# EasyEDA Pro project Doodlebot v2_2025-06-04.epro

# Schematic Schematic1
Board Name: Board1; Create Date: 2025-06-04; Page Name: P1; Project Name: Doodlebot v2; Schematic Name: Schematic1; Update Date: 2025-06-04; Company: EasyEDA.com; Page Size: A4; Version: V1.0
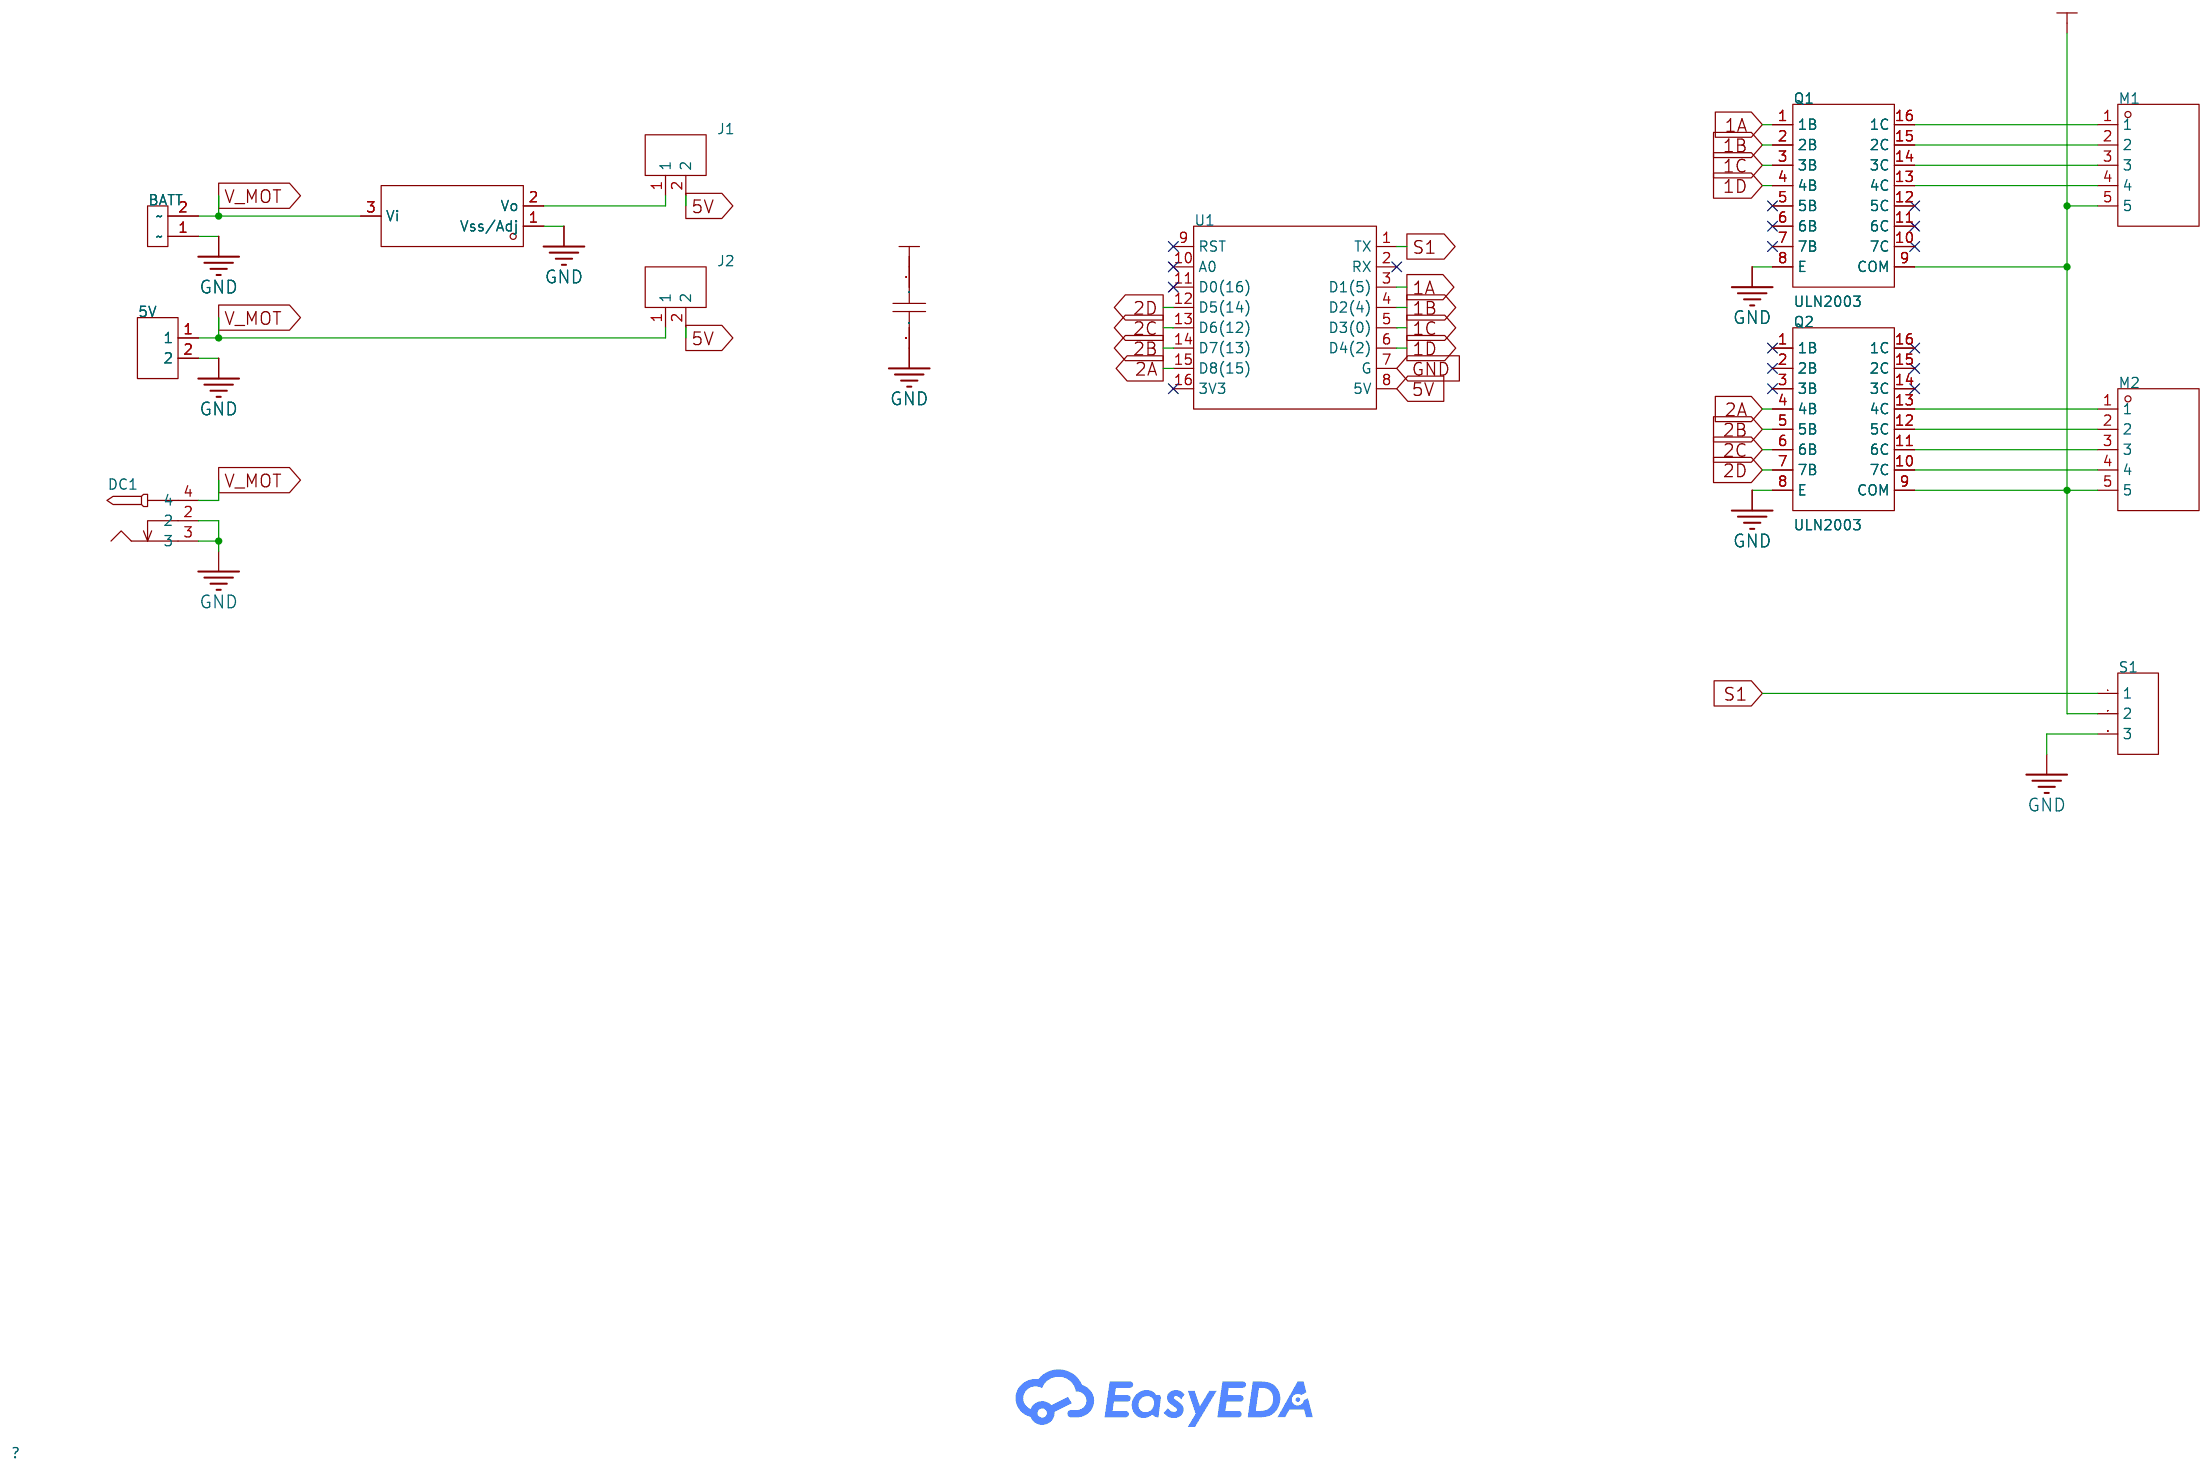
[diagram p0: schematic sheet]

## Parts
5V  PZ254V-11-02P  [HDR-TH_2P-P2.54-V-M]
BATT  JST-XH-B2B  [Connector_JST:JST_XH_B2B-XH-A_1x02_P2.50mm_Vertical]
C1  100nF  [CAP-TH_BD8.3-P3.00-D0.6-FD]
DC1  DC-005 2.0  [DC-IN-TH_DC-5520-1]
J1  PZ254V-11-02P  [HDR-TH_2P-P2.54-V-M]
J2  PZ254V-11-02P  [HDR-TH_2P-P2.54-V-M]
M1  B5B-XH-A(LF)(SN)  [CONN-TH_B5B-XH-A-LF-SN]
M2  B5B-XH-A(LF)(SN)  [CONN-TH_B5B-XH-A-LF-SN]
Q1  ULN2003  [DIP-16_L19.8-W6.5-P2.54-LS7.6-BL]
Q2  ULN2003  [DIP-16_L19.8-W6.5-P2.54-LS7.6-BL]
S1  2.54-1*3P针  [HDR-TH_3P-P2.54-V-M-1]
U1  Wemos_D1_mini_Pro4  [DIP-16_WEMOS_D1_MINI_PRO4]
U2  AMS1117-5.0  [SOT-89-3_L4.5-W2.5-P1.50-LS4.0-BR-1]

## Library data of the parts
5V J1 J2 = PZ254V-11-02P: Pin Structure:1x2P Pitch:2.54mm Row Spacing:- Circluar Pins/Square Pins:Policy Mounting Type:Straight Number of Rows:Single Row Number of Pins:2P Current Rating:- Voltage Rating (Max):- Length of Mating Pin:6mm Insulation Height:2.5mm Length of End Connec; LCSC Part Name: 1x2P 间距:2.54mm 方针 直插; Supplier Part: C492401; Manufacturer: XFCN(兴飞); Supplier Footprint: 插件,P=2.54mm; JLCPCB Part Class: Extended Part; Datasheet: https://atta.szlcsc.com/upload/public/pdf/source/20200309/C492401_A812433581A9B211A7FFA413ADDFF0E5.pdf; Supplier: LCSC; Pin Structure: 1x2P; Pitch: 2.54mm; Circluar Pins/Square Pins: Policy; Mounting Type: Straight; Number of Rows: Single Row; Number of Pins: 2P; Length of Mating Pin: 6mm; Insulation Height: 2.5mm; Length of End Connection Pin: 3mm; Contact Material: Brass; Operating Temperature: -40℃~+105℃; Color: Black
BATT = StanleyProjects_J_JST-XH-B2B: User doc link: http://www.jst-mfg.com/product/pdf/eng/eXH.pdf; MPN: B2B-XH-A(LF)(SN); Manufacturer: JST Sales America; Package1: Through Hole, P=2.5mm
C1 = CAP_0603: Supplier Footprint: 0603
DC1 = DC-005 2.0: Connector Type:DC Power Receptacle Mounting Style:Bend insert Inside Contact Diameter:2mm Outside Contact Diameter:6.4mm Current Rating (Max):1A Voltage Rating (Max):12V Operating Temperature Range:-25℃~+85℃ Operating Temperature Range:-25℃~+85℃; LCSC Part Name: DC电源插座 内径:2mm 外径:6.4mm; Supplier Part: C16214; Manufacturer: BOOMELE(博穆精密); Supplier Footprint: 插件; JLCPCB Part Class: Extended Part; Datasheet: https://atta.szlcsc.com/upload/public/pdf/source/20230822/A395081E7D04348211A5D528B2AFD8E0.pdf; Supplier: LCSC; Connector Type: DC Power Receptacle; Mounting Style: Bend insert; Inside Contact Diameter: 2mm; Outside Contact Diameter: 6.4mm; Current Rating (Max): 1A; Voltage Rating (Max): 12V; Operating Temperature Range: -25℃~+85℃
M1 M2 = B5B-XH-A(LF)(SN): Pins Structure:1x5P Pitch:2.5mm Mounting Style:Direct Insert Reference Series:XH Number of Pins:5P Number of Rows:1 Number of PINs Per Row:5 Row Spacing:- Current Rating (Max):3A Contact Material:Brass Contact Plating:Tin Operating Temperature Range:-25℃~; LCSC Part Name: 1x5P 间距:2.5mm 直插 系列:XH; Supplier Part: C157991; Manufacturer: JST; Supplier Footprint: 插件,P=2.5mm; JLCPCB Part Class: Extended Part; Datasheet: https://atta.szlcsc.com/upload/public/pdf/source/20180928/C265283_F9DFEEBDB2CF642B6BDFAB4B77BD2680.pdf; Supplier: LCSC; Pins Structure: 1x5P; Pitch: 2.5mm; Mounting Style: Direct Insert; Reference Series: XH; Number of Pins: 5P; Number of Rows: 1; Number of PINs Per Row: 5; Current Rating (Max): 3A; Contact Material: Brass; Contact Plating: Tin; Operating Temperature Range: -25℃~+85℃; Rated Voltage (Max): 250V; Plastic Material: PA66; Flame Retardant Rating: UL94V-0; Supplementary Features: K-leg punch; Colour: White; Z-Height of the Board: 7mm; X-Length of Bottom Edge on Board (Spacing Line): 14.9mm; Y-Width of Bottom Edge on Board: 5.75mm
Q1 Q2 = ULN2003_C557872: number of channels:Seven channels; Supplier Part: C557872; Manufacturer: YW(友旺); Supplier Footprint: DIP-16; JLCPCB Part Class: Extended Part; Datasheet: https://atta.szlcsc.com/upload/public/pdf/source/20200527/C557873_2AFF25600AE9CE704FFBA5741FE31C9F.pdf; Supplier: LCSC; number of channels: Seven channels
S1 = 2.54-1*3P针: Pin Structure:1x3P Pitch:2.54mm Row Spacing:- Circluar Pins/Square Pins:Policy Mounting Type:Direct Insert Number of Rows:Single Row Number of Pins:3P Current Rating (Max):3A Voltage Rating (Max):- Length of Mating Pin:- Insulation Height:- Length of End; LCSC Part Name: 间距:2.54mm 1x3P 直插 方针; Supplier Part: C49257; Manufacturer: BOOMELE(博穆精密); Supplier Footprint: 插件,P=2.54mm; JLCPCB Part Class: Extended Part; Datasheet: https://atta.szlcsc.com/upload/public/pdf/source/20221018/3E9408392E35E6F57A28985E5F7BF5C9.pdf; Supplier: LCSC; Pin Structure: 1x3P; Pitch: 2.54mm; Circluar Pins/Square Pins: Policy; Mounting Type: Direct Insert; Number of Rows: Single Row; Number of Pins: 3P; Current Rating (Max): 3A; Operating Temperature Range: -40℃~+105℃; Color: Black
U1 = Wemos_D1_mini_Pro4: Supplier Part: C2837266; Supplier Footprint: DIP-16; JLCPCB Part Class: Extended Part; Supplier: LCSC
U2 = AMS1117-5.0_C42410722: Output Type:Fixed Voltage - Supply:15V Output Voltage:- Output Voltage:- Output Current:10mA Power Supply Rejection Ratio (PSRR):- Voltage Dropout:1.2V@(800mA) standby current:2mA Noise:0.003%Vout Features:Overheat protection Operating Temperature:-40℃~+1; Supplier Part: C42410722; Manufacturer: FOSAN(富捷/富信); Supplier Footprint: SOT-89; Datasheet: https://atta.szlcsc.com/upload/public/pdf/source/20240301/FDECE732DE52FCFDD6378B70FEB6E4DD.pdf; Supplier: LCSC; Output Type: Fixed; Voltage - Supply: 15V; Output Current: 10mA; Voltage Dropout: 1.2V@(800mA); standby current: 2mA; Noise: 0.003%Vout; Features: Overheat protection; Operating Temperature: -40℃~+125℃; Output Configuration: Positive electrode; Number of Outputs: 1

## Nets
5V: J1.2 J2.2 U1.8(5V)
GND: 5V.2 BATT.1 C1.2 DC1.2 DC1.3 Q1.8(E) Q2.8(E) S1.3 U1.7(G) U2.1(Vss/Adj)
1A: Q1.1(1B) U1.3(D1(5))
1B: Q1.2(2B) U1.4(D2(4))
1C: Q1.3(3B) U1.5(D3(0))
1D: Q1.4(4B) U1.6(D4(2))
2A: Q2.4(4B) U1.15(D8(15))
2B: Q2.5(5B) U1.14(D7(13))
2C: Q2.6(6B) U1.13(D6(12))
2D: Q2.7(7B) U1.12(D5(14))
S1: S1.1 U1.1(TX)
V_MOT: 5V.1 BATT.2 C1.1 DC1.4 J2.1 M1.5 M2.5 Q1.9(COM) Q2.9(COM) S1.2 U2.3(Vi)
$1N866: M1.1 Q1.16(1C)
$1N870: M1.2 Q1.15(2C)
$1N875: M1.3 Q1.14(3C)
$1N880: M1.4 Q1.13(4C)
$1N922: M2.1 Q2.13(4C)
$1N926: M2.2 Q2.12(5C)
$1N931: M2.3 Q2.11(6C)
$1N2260: J1.1 U2.2(Vo)
$1N3051: M2.4 Q2.10(7C)

Not connected (* = marked no-connect by the designer): Q1 5(5B)* 6(6B)* 7(7B)* 10(7C)* 11(6C)* 12(5C)*; Q2 1(1B)* 2(2B)* 3(3B)* 14(3C)* 15(2C)* 16(1C)*; U1 2(RX)* 9(RST)* 10(A0)* 11(D0(16))* 16(3V3)*

# Board PCB1
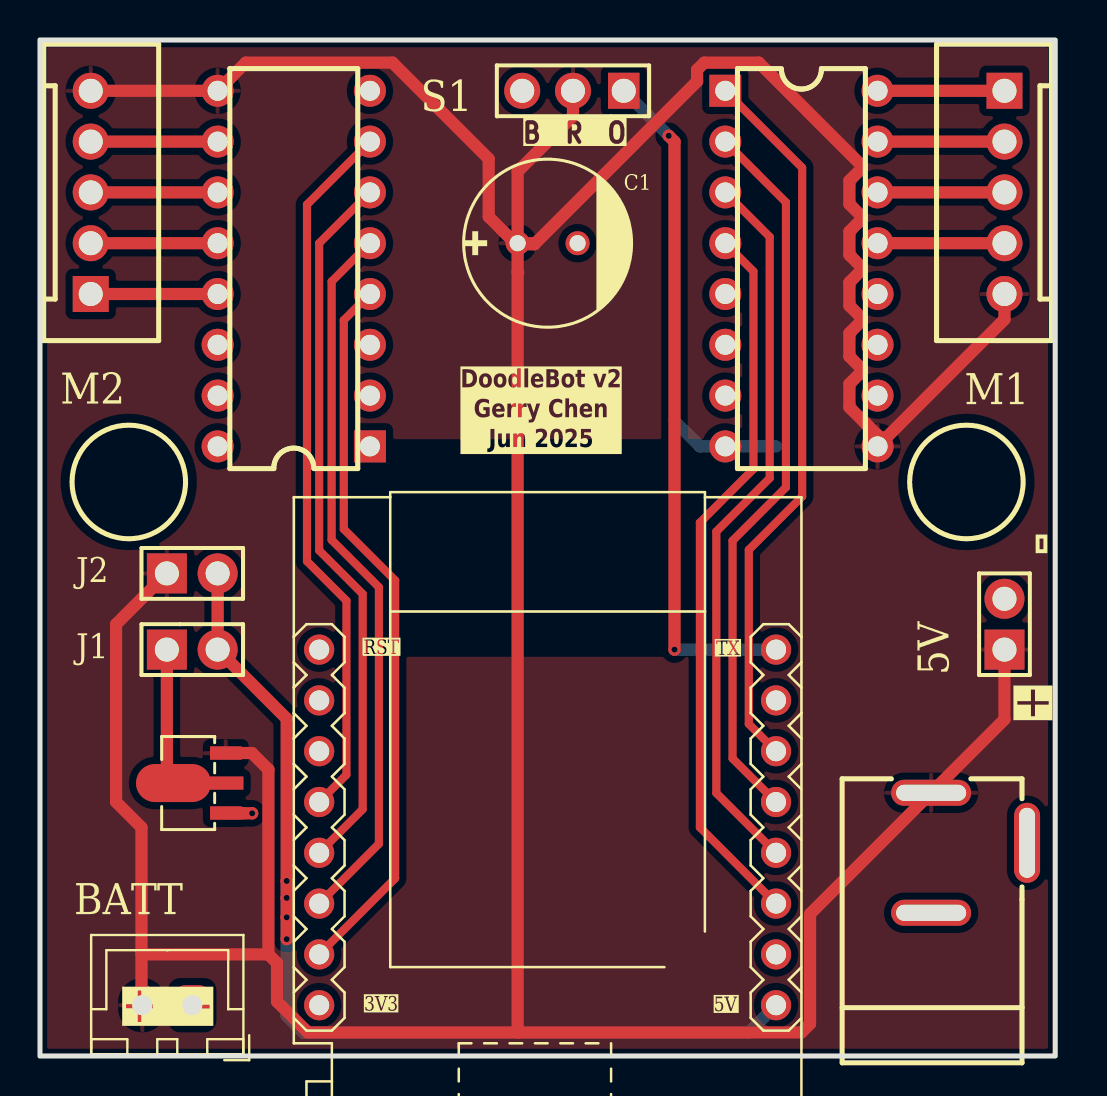
[diagram p1: board, top side]
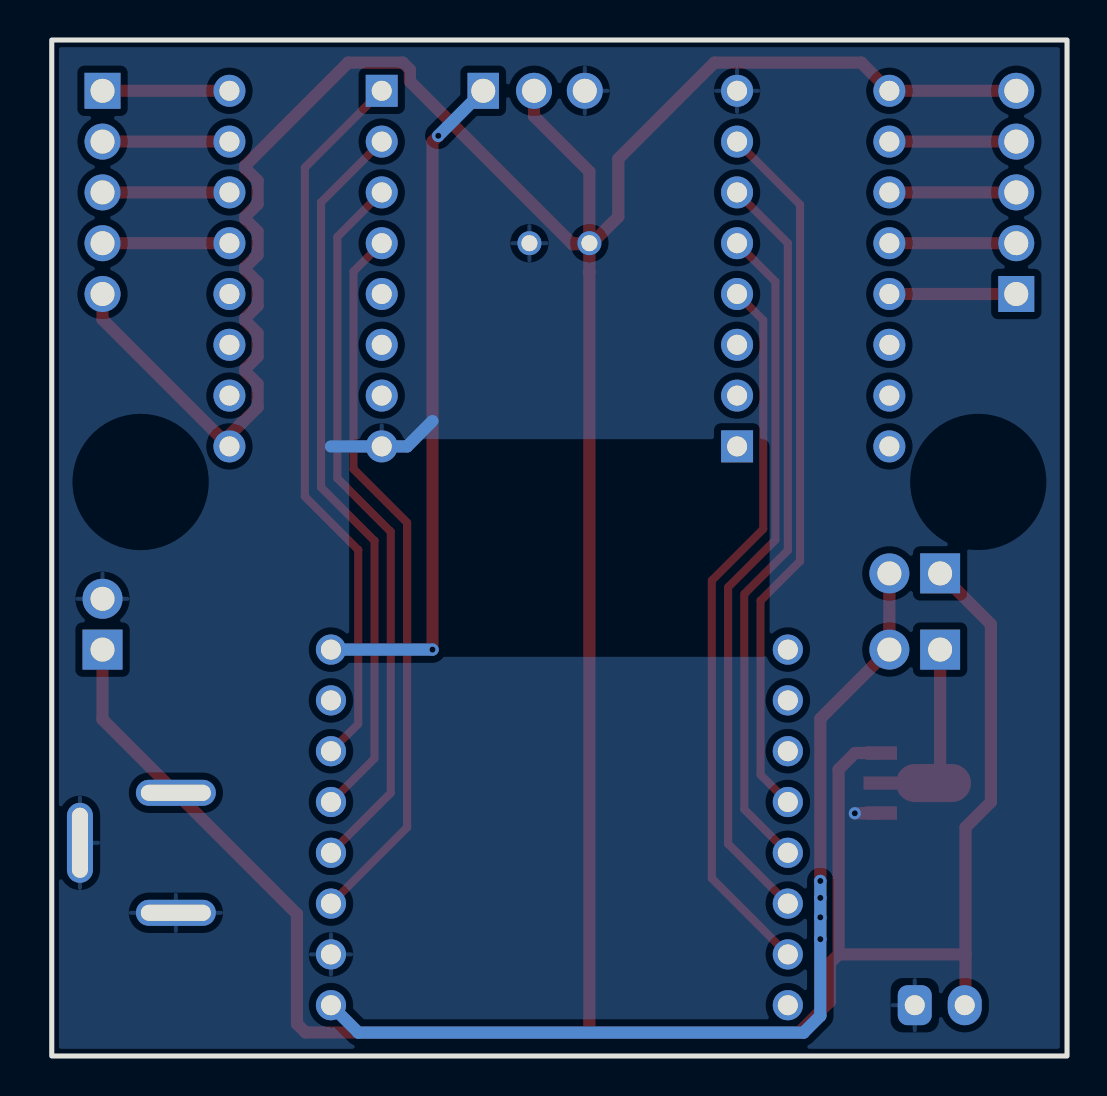
[diagram p2: board, bottom side, seen from below]

Outline 50.8 x 50.8 mm; copper layers: Top Layer, Bottom Layer. Coordinates in mm from the lower left corner of the outline.
Outline path: rectangle 0,50.8 50.8,0
Stack: Top Layer 0.035mm / Dielectric1 1.51mm FR4 er 4.5 / Bottom Layer 0.035mm

## Design rules (mm)
template: Custom Config
spacing copperThickness1oz (default): track to track 0.203, other pairs 0.152 to 0.305
spacing copperThickness2oz: track to track 0.203, other pairs 0.152 to 0.3
track width copperThickness1oz (default): min 0.305, default 0.61, max 2.54
track width copperThickness2oz: min 0.203, default 0.254, max 2.54
differential pair differentialPair (default): width min 0.127, default 0.254, max 2.54; gap min 0.152, default 0.152
via viaSize (default): diameter min 0.5, default 0.61, max 10; hole min 0.3, default 0.305, max 6.299

## Placement (name value [footprint] x y rotation side)
5V  PZ254V-11-02P  [HDR-TH_2P-P2.54-V-M]  48.26 21.59 90 top
BATT  JST-XH-B2B  [Connector_JST:JST_XH_B2B-XH-A_1x02_P2.50mm_Vertical]  7.62 2.54 180 top
C1  100nF  [CAP-TH_BD8.3-P3.00-D0.6-FD]  25.4 40.64 0 top
DC1  DC-005 2.0  [DC-IN-TH_DC-5520-1]  46.99 10.16 90 top
J1  PZ254V-11-02P  [HDR-TH_2P-P2.54-V-M]  7.62 20.32 0 top
J2  PZ254V-11-02P  [HDR-TH_2P-P2.54-V-M]  7.62 24.13 0 top
M1  B5B-XH-A(LF)(SN)  [CONN-TH_B5B-XH-A-LF-SN]  48.26 43.18 90 top
M2  B5B-XH-A(LF)(SN)  [CONN-TH_B5B-XH-A-LF-SN]  2.54 43.18 270 top
Q1  ULN2003  [DIP-16_L19.8-W6.5-P2.54-LS7.6-BL]  38.1 39.37 270 top
Q2  ULN2003  [DIP-16_L19.8-W6.5-P2.54-LS7.6-BL]  12.7 39.37 90 top
S1  2.54-1*3P针  [HDR-TH_3P-P2.54-V-M-1]  26.67 48.26 180 top
U1  Wemos_D1_mini_Pro4  [DIP-16_WEMOS_D1_MINI_PRO4]  25.4 11.43 0 top
U2  AMS1117-5.0  [SOT-89-3_L4.5-W2.5-P1.50-LS4.0-BR-1]  7.99 13.65 0 top

## Footprints (pads in the part's own frame, mm; a bottom-side part is the same pattern mirrored in y, then rotated)
CAP-TH_BD8.3-P3.00-D0.6-FD
  round 1.202 hole 0.801: 1(-1.5,0) 2(1.5,0)
CONN-TH_B5B-XH-A-LF-SN
  rect 1.8x1.8 hole 1.2: 1(5.08,0)
  round 1.8 hole 1.2: 2(2.54,0) 3(0,0) 4(-2.54,0) 5(-5.08,0)
Connector_JST:JST_XH_B2B-XH-A_1x02_P2.50mm_Vertical
  rrect 1.7x2 hole 1: 1(0,0)
  oval 1.7x2 hole 1: 2(2.5,0)
DC-IN-TH_DC-5520-1
  oval 4x1.3 hole 3.5x0.8: 2(0.5,-2.4)
  oval 1.3x4 hole 0.8x3.5: 3(-3,2.4) 4(3,2.4)
DIP-16_L19.8-W6.5-P2.54-LS7.6-BL
  rect 1.6x1.6 hole 1: 1(-8.89,-3.81)
  round 1.6 hole 1: 2(-6.35,-3.81) 3(-3.81,-3.81) 4(-1.27,-3.81) 5(1.27,-3.81) 6(3.81,-3.81) 7(6.35,-3.81) 8(8.89,-3.81) 9(8.89,3.81) 10(6.35,3.81) 11(3.81,3.81) 12(1.27,3.81) 13(-1.27,3.81) 14(-3.81,3.81) 15(-6.35,3.81) 16(-8.89,3.81)
DIP-16_WEMOS_D1_MINI_PRO4
  round 1.508 hole 1x1: 1(11.43,8.89) 2(11.43,6.35) 3(11.43,3.81) 4(11.43,1.27) 5(11.43,-1.27) 6(11.43,-3.81) 7(11.43,-6.35) 8(11.43,-8.89) 9(-11.43,8.89) 10(-11.43,6.35) 11(-11.43,3.81) 12(-11.43,1.27) 13(-11.43,-1.27) 14(-11.43,-3.81) 15(-11.43,-6.35) 16(-11.43,-8.89)
HDR-TH_2P-P2.54-V-M
  rect 2x2 hole 1.2: 1(-1.27,0)
  round 2 hole 1.2: 2(1.27,0)
HDR-TH_3P-P2.54-V-M-1
  rect 1.575x1.8 hole 1.2: 1(-2.54,0)
  round 1.8 hole 1.2: 2(0,0) 3(2.54,0)
SOT-89-3_L4.5-W2.5-P1.50-LS4.0-BR-1
  rect 1.575x0.672 smd: 1(1.306,-1.5) 3(1.306,1.5)
  custom 5.377x1.9 smd: 2(-1.306,0)

## Nets
As in the schematic.

Pads without a net: Q1 5 6 7 10 11 12; Q2 1 2 3 14 15 16; U1 2 9 10 11 16

## Via types
v1: diameter 0.61, hole 0.305, Top Layer to Bottom Layer, 7 vias

## Routing (per net, layer and track width the routed paths; a pad name or vN(x,y) marks a point on that pad's centre or on a via; arc(x,y) is an arc through that point)
5V: length 51.9
  Top Layer w0.61: J2.2 J1.2 12.34,16.87 v1(12.34,8.75) v1(12.34,7.91) v1(12.34,6.93) v1(12.34,5.84)
  Bottom Layer w0.61: U1.8 35.46,1.17 13.18,1.17 12.34,2.01 v1(12.34,5.84) v1(12.34,6.93) v1(12.34,7.91) v1(12.34,8.75)
GND: length 6.9
  Top Layer w0.61: v1(10.62,12.14) 10.17,12.14 10.16,12.15 U2.1
  Bottom Layer w0.61: 31.75,31.75 33.02,30.48 Q1.8 36.83,30.48
1A: length 36.3
  Top Layer w0.406: U1.3 35.47,16.6 35.47,25.31 38.14,27.98 38.14,44.41 Q1.1
1B: length 36.3
  Top Layer w0.406: Q1.2 37.32,42.69 37.32,28.44 34.65,25.76 34.65,14.88 U1.4
1C: length 36.3
  Top Layer w0.406: Q1.3 36.51,40.96 36.51,28.89 33.84,26.22 33.84,13.15 U1.5
1D: length 36.3
  Top Layer w0.406: U1.6 33.02,11.43 33.02,26.67 35.7,29.35 35.7,39.23 Q1.4
2A: length 36.2
  Top Layer w0.406: Q2.4 15.2,36.79 15.2,26.35 17.77,23.78 17.77,8.88 U1.15
2B: length 36
  Top Layer w0.406: U1.14 16.96,10.61 16.96,23.44 14.59,25.81 14.59,38.72 Q2.5
2C: length 35.9
  Top Layer w0.406: U1.13 16.15,12.34 16.15,23.1 13.97,25.28 13.97,40.64 Q2.6
2D: length 35.7
  Top Layer w0.406: U1.12 15.33,14.06 15.33,22.77 13.36,24.74 13.36,42.57 Q2.7
S1: length 34.1
  Top Layer w0.61: v1(31.75,20.32) 31.75,45.72 v1(31.46,46.01)
  Bottom Layer w0.61: S1.1 v1(31.46,46.01) ; U1.1 v1(31.75,20.32)
V_MOT: length 221.1
  Top Layer w0.61: 5.08,5.08 5.08,11.43 3.81,12.7 3.81,21.59 J2.1 ; 5.08,5.08 5.08,2.58 BATT.2 ; 5.08,5.08 11.43,5.08 ; 23.9,40.87 23.54,40.87 22.45,41.96 22.45,44.86 17.64,49.67 10.3,49.67 Q2.9 M2.5 ; 23.9,40.87 23.9,44.22 26.67,46.99 S1.2 ; 23.9,40.87 C1.1 ; 23.9,40.87 23.93,40.84 ; C1.1 23.95,40.59 24.74,40.59 ; C1.1 24.69,40.64 24.74,40.59 ; C1.1 23.9,39.19 ; 24.74,40.59 32.88,48.73 32.88,49.31 33.24,49.67 35.97,49.67 41.11,44.53 41.11,44.37 40.5,43.76 40.5,42.6 41.11,41.99 41.11,41.83 40.5,41.22 40.5,40.06 41.11,39.45 41.11,39.29 40.5,38.68 40.5,37.52 41.11,36.91 41.11,36.75 40.5,36.14 40.5,34.98 41.11,34.37 41.11,34.21 40.5,33.6 40.5,32.44 41.33,31.61 41.34,31.61 41.91,31.04 Q1.9 48.26,36.83 M1.5 ; 5V.1 48.26,16.83 DC1.4 38.53,7.1 38.53,1.61 38.1,1.18 23.95,1.18 ; 23.95,1.18 23.9,1.23 23.9,39.19 ; 23.95,1.18 13.41,1.18 11.86,2.72 11.86,4.65 11.43,5.08 ; 23.9,39.19 23.93,39.17 ; 11.43,5.08 11.43,14.33 10.61,15.15 U2.3
$1N866: length 6.3
  Top Layer w0.61: Q1.16 M1.1
$1N870: length 6.3
  Top Layer w0.61: Q1.15 M1.2
$1N875: length 6.3
  Top Layer w0.61: Q1.14 M1.3
$1N880: length 6.3
  Top Layer w0.61: Q1.13 M1.4
$1N922: length 6.3
  Top Layer w0.61: Q2.13 M2.1
$1N926: length 6.3
  Top Layer w0.61: M2.2 Q2.12
$1N931: length 6.3
  Top Layer w0.61: Q2.11 M2.3
$1N2260: length 8.1
  Top Layer w0.61: 7.95,13.65 6.67,13.65 6.35,13.97 J1.1
$1N3051: length 6.3
  Top Layer w0.61: M2.4 Q2.10

## Copper pours and planes (outline as drawn; the poured copper is in the pictures)
GND on Bottom Layer: 0,50.8 50.8,50.8 50.8,0 0,0
AOEU on Top Layer: 15.24,30.48 35.56,30.48 35.56,20.32 15.24,20.32
AOEU on Top Layer: 7.49,28.87 7.45,29.21 7.37,29.55 7.26,29.87 7.11,30.18 6.93,30.47 6.72,30.73 6.48,30.97 6.21,31.19 5.92,31.37 5.61,31.52 5.29,31.63 4.96,31.71 4.62,31.75 4.27,31.75 3.93,31.71 3.6,31.63 3.28,31.52 2.97,31.37 2.68,31.19 2.41,30.97 2.17,30.73 1.96,30.47 1.78,30.18 1.63,29.87 1.52,29.55 1.44,29.21 1.4,28.87 1.4,28.53 1.44,28.19 1.52,27.86 1.63,27.54 1.78,27.23 1.96,26.94 2.17,26.67 2.41,26.43 2.68,26.22 2.97,26.03 3.28,25.89 3.6,25.77 3.93,25.7 4.27,25.66 4.62,25.66 4.96,25.7 5.29,25.77 5.61,25.89 5.92,26.03 6.21,26.22 6.48,26.43 6.72,26.67 6.93,26.94 7.11,27.23 7.26,27.54 7.37,27.86 7.45,28.19 7.49,28.53
AOEU on Top Layer: 49.4,28.87 49.36,29.21 49.28,29.55 49.17,29.87 49.02,30.18 48.84,30.47 48.63,30.73 48.39,30.97 48.12,31.19 47.83,31.37 47.52,31.52 47.2,31.63 46.87,31.71 46.53,31.75 46.18,31.75 45.84,31.71 45.51,31.63 45.19,31.52 44.88,31.37 44.59,31.19 44.32,30.97 44.08,30.73 43.87,30.47 43.69,30.18 43.54,29.87 43.43,29.55 43.35,29.21 43.31,28.87 43.31,28.53 43.35,28.19 43.43,27.86 43.54,27.54 43.69,27.23 43.87,26.94 44.08,26.67 44.32,26.43 44.59,26.22 44.88,26.03 45.19,25.89 45.51,25.77 45.84,25.7 46.18,25.66 46.53,25.66 46.87,25.7 47.2,25.77 47.52,25.89 47.83,26.03 48.12,26.22 48.39,26.43 48.63,26.67 48.84,26.94 49.02,27.23 49.17,27.54 49.28,27.86 49.36,28.19 49.4,28.53
AOEU on Bottom Layer: 15.24,30.48 35.56,30.48 35.56,20.32 15.24,20.32
AOEU on Bottom Layer: 7.49,28.87 7.45,29.21 7.37,29.55 7.26,29.87 7.11,30.18 6.93,30.47 6.72,30.73 6.48,30.97 6.21,31.19 5.92,31.37 5.61,31.52 5.29,31.63 4.96,31.71 4.62,31.75 4.27,31.75 3.93,31.71 3.6,31.63 3.28,31.52 2.97,31.37 2.68,31.19 2.41,30.97 2.17,30.73 1.96,30.47 1.78,30.18 1.63,29.87 1.52,29.55 1.44,29.21 1.4,28.87 1.4,28.53 1.44,28.19 1.52,27.86 1.63,27.54 1.78,27.23 1.96,26.94 2.17,26.67 2.41,26.43 2.68,26.22 2.97,26.03 3.28,25.89 3.6,25.77 3.93,25.7 4.27,25.66 4.62,25.66 4.96,25.7 5.29,25.77 5.61,25.89 5.92,26.03 6.21,26.22 6.48,26.43 6.72,26.67 6.93,26.94 7.11,27.23 7.26,27.54 7.37,27.86 7.45,28.19 7.49,28.53
AOEU on Bottom Layer: 49.4,28.87 49.36,29.21 49.28,29.55 49.17,29.87 49.02,30.18 48.84,30.47 48.63,30.73 48.39,30.97 48.12,31.19 47.83,31.37 47.52,31.52 47.2,31.63 46.87,31.71 46.53,31.75 46.18,31.75 45.84,31.71 45.51,31.63 45.19,31.52 44.88,31.37 44.59,31.19 44.32,30.97 44.08,30.73 43.87,30.47 43.69,30.18 43.54,29.87 43.43,29.55 43.35,29.21 43.31,28.87 43.31,28.53 43.35,28.19 43.43,27.86 43.54,27.54 43.69,27.23 43.87,26.94 44.08,26.67 44.32,26.43 44.59,26.22 44.88,26.03 45.19,25.89 45.51,25.77 45.84,25.7 46.18,25.66 46.53,25.66 46.87,25.7 47.2,25.77 47.52,25.89 47.83,26.03 48.12,26.22 48.39,26.43 48.63,26.67 48.84,26.94 49.02,27.23 49.17,27.54 49.28,27.86 49.36,28.19 49.4,28.53
V_MOT on Top Layer: 0,50.8 50.8,50.8 50.8,0 0,0

## Text on the board
Top Silkscreen Layer: B  R  O | DoodleBot v2 / Gerry Chen / Jun 2025 | RST | 3V3 | 5V | TX | +   - | + | -
